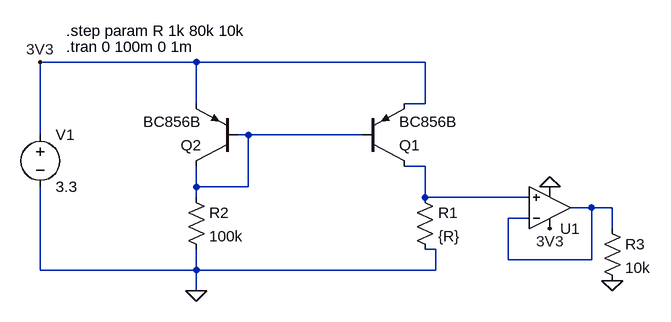
[diagram p0: schematic Draft1.asc]
Draft1.asc, the LTspice schematic file:
Version 4
SHEET 1 880 680
WIRE -128 0 -368 0
WIRE 224 0 -128 0
WIRE -128 64 -128 0
WIRE 224 64 224 0
WIRE 224 64 192 64
WIRE -368 112 -368 0
WIRE -48 112 -64 112
WIRE 128 112 -48 112
WIRE 224 160 192 160
WIRE -128 192 -128 160
WIRE -48 192 -48 112
WIRE -48 192 -128 192
WIRE -128 208 -128 192
WIRE 224 208 224 160
WIRE 384 208 224 208
WIRE 480 224 448 224
WIRE 512 224 480 224
WIRE 384 240 352 240
WIRE 512 256 512 224
WIRE 240 288 224 288
WIRE 352 304 352 240
WIRE 480 304 480 224
WIRE 480 304 352 304
WIRE -368 320 -368 192
WIRE -128 320 -128 288
WIRE -128 320 -368 320
WIRE 240 320 240 288
WIRE 240 320 -128 320
WIRE -128 352 -128 320
FLAG -128 352 0
FLAG 512 336 0
FLAG 416 192 0
FLAG -368 0 3V3
FLAG 416 256 3V3
SYMBOL pnp 128 160 M180
SYMATTR InstName Q1
SYMATTR Value BC856B
SYMBOL pnp -64 160 R180
SYMATTR InstName Q2
SYMATTR Value BC856B
SYMBOL res 208 192 R0
SYMATTR InstName R1
SYMATTR Value {R}
SYMBOL res -144 192 R0
SYMATTR InstName R2
SYMATTR Value 100k
SYMBOL voltage -368 96 R0
WINDOW 123 0 0 Left 0
WINDOW 39 0 0 Left 0
SYMATTR InstName V1
SYMATTR Value 3.3
SYMBOL res 496 240 R0
SYMATTR InstName R3
SYMATTR Value 10k
SYMBOL OpAmps\\UniversalOpAmp 416 224 M180
SYMATTR InstName U1
TEXT -328 -48 Left 2 !.step param R 1k 80k 10k
TEXT -328 -24 Left 2 !.tran 0 100m 0 1m

The netlist it stands for:
* Draft1.asc
Q1 N002 N001 3V3 0 BC856B
Q2 N001 N001 3V3 0 BC856B
R1 N002 0 {R}
R2 N001 0 100k
V1 3V3 0 3.3
R3 N003 0 10k
XU1 N002 N003 3V3 0 N003 level1 Avol=1Meg GBW=10Meg Vos=0 En=0 Enk=0 In=0 Ink=0 Rin=500Meg  ; pins In+ In- V+ V- OUT
.model NPN NPN
.model PNP PNP
.lib standard.bjt
.step param R 1k 80k 10k
.tran 0 100m 0 1m
.lib UniversalOpAmp1.lib
.backanno
.end